# Altium schematic sheet Digital_Input.SchDoc
size A3; SheetNumber: 3; SheetTotal: 5
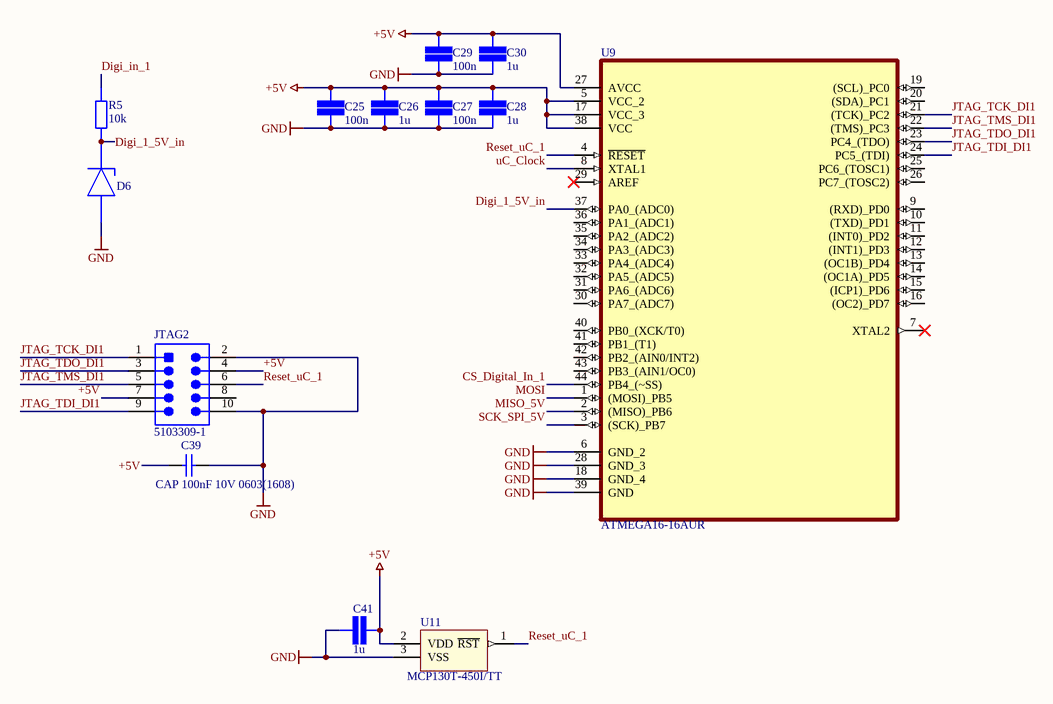
[diagram p0: Digital_Input.SchDoc]

## Parts
C25  value 100n  [CAP 0603/1608]  (hidden comment: SMD Capacitor)
C26  value 1u  [CAP 0603/1608]  (hidden comment: SMD Capacitor)
C27  value 100n  [CAP 0603/1608]  (hidden comment: SMD Capacitor)
C28  value 1u  [CAP 0603/1608]  (hidden comment: SMD Capacitor)
C29  value 100n  [CAP 0603/1608]  (hidden comment: SMD Capacitor)
C30  value 1u  [CAP 0603/1608]  (hidden comment: SMD Capacitor)
C39  CAP 100nF 10V 0603(1608)  [CAPC0603(1608)100_L]
C41  value 1u  [CAP 0603/1608]  (hidden comment: SMD Capacitor)
D6  MM3Z4V7T1G  [SOD-323-2]  (value not drawn)
JTAG2  5103309-1  [TECO-5103309-1_V]
R5  value 10k  [STACKPOLE CSR0603]  (hidden comment: SMD Resistor)
U9  ATMEGA16-16AUR  [QFP80P1200X1200X120-44N]
U11  MCP130T-450I/TT  [*SOT95P237X112-3N]

## Nets
+5V: C25.2 C26.2 C27.2 C28.2 C29.2 C30.2 C39.1 C41.1 JTAG2.4 JTAG2.7 U9.5(VCC_2) U9.17(VCC_3) U9.27(AVCC) U9.38(VCC) U11.2(VDD)
GND: C25.1 C26.1 C27.1 C28.1 C29.1 C30.1 C39.2 C41.2 D6.2A(A) JTAG2.2 JTAG2.10 U9.6(GND_2) U9.18(GND_4) U9.28(GND_3) U9.39(GND) U11.3(VSS)
CS_Digital_In_1: U9.44(PB4_(~SS))
Digi_1_5V_in: D6.1C(C) R5.2 U9.37(PA0_(ADC0))
Digi_in_1: R5.1
JTAG_TCK_DI1: JTAG2.1 U9.21((TCK)_PC2)
JTAG_TDI_DI1: JTAG2.9 U9.24(PC5_(TDI))
JTAG_TDO_DI1: JTAG2.3 U9.23(PC4_(TDO))
JTAG_TMS_DI1: JTAG2.5 U9.22((TMS)_PC3)
MISO_5V: U9.2((MISO)_PB6)
MOSI: U9.1((MOSI)_PB5)
Reset_uC_1: JTAG2.6 U9.4(~{RESET}) U11.1(~{RST})
SCK_SPI_5V: U9.3((SCK)_PB7)
uC_Clock: U9.8(XTAL1)

Not connected (* = marked no-connect by the designer): JTAG2 8; U9 7(XTAL2)* 9((RXD)_PD0) 10((TXD)_PD1) 11((INT0)_PD2) 12((INT1)_PD3) 13((OC1B)_PD4) 14((OC1A)_PD5) 15((ICP1)_PD6) 16((OC2)_PD7) 19((SCL)_PC0) 20((SDA)_PC1) 25(PC6_(TOSC1)) 26(PC7_(TOSC2)) 29(AREF)* 30(PA7_(ADC7)) 31(PA6_(ADC6)) 32(PA5_(ADC5)) 33(PA4_(ADC4)) 34(PA3_(ADC3)) 35(PA2_(ADC2)) 36(PA1_(ADC1)) 40(PB0_(XCK/T0)) 41(PB1_(T1)) 42(PB2_(AIN0/INT2)) 43(PB3_(AIN1/OC0))

## Library data of the parts
C25-C30 C41 = SMD Capacitor: Capacitor with multiple Footprints
C39 = CMP-1035-02579-1: CAP 100nF 10V ±5% 0603 (1608 Metric) Thickness 1mm SMD; Tolerance: Â±5%; Case-EIA: 0603; Case-Metric: 1608; Value: 100nF; Max Thickness: 1 mm; Rated Voltage: 10 V; Technology: SMT
D6 = MM3Z4V7T1G: onsemi MM3Z4V7T1G / Z-Diode, 4,7V; ComponentLink1Description: Octopart; ComponentLink1URL: https://octopart.com/mm3z4v7t1g-onsemi-331144?r=sp
JTAG2 = CMP-2000-07502-1: Male Header, Pitch 2.54 mm, 2 x 5 Position, Height 9.855 mm, Tail Length 3.048 mm, -65 to 105 degC, RoHS, Tube; Manufacturer: TE Connectivity; PCB Mounting Orientation: Vertical; Pitch: 2.54mm; Mating Connector Lock: No(Without); Body Material: Thermoplastic; Shrouded: Yes(With); Connector System: Wire-to-Board; Insulation Resistance: 5GR; Number of Positions: 10; Max Current Rating: 1A; PCB Mount Retention: Without; Manufacturer URL: http://www.te.com/; Contact Plating: Gold; Datasheet URL: http://www.te.com/commerce/DocumentDelivery/DDEController?Action=showdoc&DocId=Customer+Drawing%7F5103309%7FE1%7Fpdf%7FEnglish%7FENG_CD_5103309_E1.pdf%7F5103309-1; Colour: Black; Termination: ThroughHole; Housing Colour: Black; Flammability Rating: UL94V-0; Package Description: Male Header, Pitch 2.54 mm, 2 x 5 Position, Height 9.855 mm, Tail Length 3.048 mm; Mating Retention: No(Without); Orientation: Straight; Row Spacing: 2.54mm; Termination Post Length: 0.12inch; Min Operating Temperature: -65degC; Board Standoff: Yes(With); REACH SVHC: NoSVHC; Depth: 9.14mm; Lead Free: LeadFree; Gender: Male; Connector Type: Header; Shrouded End Dimension: 3.81mm; ELV: Compliant; Mating Alignment: Yes(With); Panel Mount Retention: No(Without); Package Quantity: 35; PCB Mount Alignment: No(Without); Number of Rows: 2; Package Reference: 5103309-1; Mounting Technology: ThroughHole; Mount: ThroughHole; Contact Gender: Male; Number of Contacts: 10; Length: 0.8inch; Current Rating: 1A; Contact Mating Length: 0.24inch; Max Operating Temperature: 105degC; RoHSCompliant: True; Datasheet Version: Rev. E1, 03/2011; Contact Shape: Square; Height: 8.813mm; Housing Material: PBT; Contact Material: CopperAlloy; Packaging: Rail/Tube
R5 = SMD Resistor: Resistor with multiple footprints
U9 = ATMEGA16-16AUR: 8-bit Microcontroller; Package: None; Price: None; Value: *; MP: ATMEGA16-16AUR; Availability: Unavailable
U11 = MCP130T-450I/TT: System Supervisors - Power Supply Monitors with Reset Generators Open Drain Low; MF: Microchip; MP: MCP120T-450I/TT; Price: None; SnapEDA_Link: https://www.snapeda.com/parts/MCP120T-450I/TT/Microchip/view-part/?ref=snap; Package: SOT-23-3 Microchip; Availability: Unavailable; Value: *